# Altium schematic sheet TE0706.SchDoc: Overview
size A4; Organization: Trenz Electronic GmbH; DocumentNumber: TE0706; Revision: 02; SheetNumber: 1; SheetTotal: 10; Date: 2016-06-28; Author: Vitali Tsiukala; DrawnBy: Vitali Tsiukala; Engineer: Vitali Tsiukala
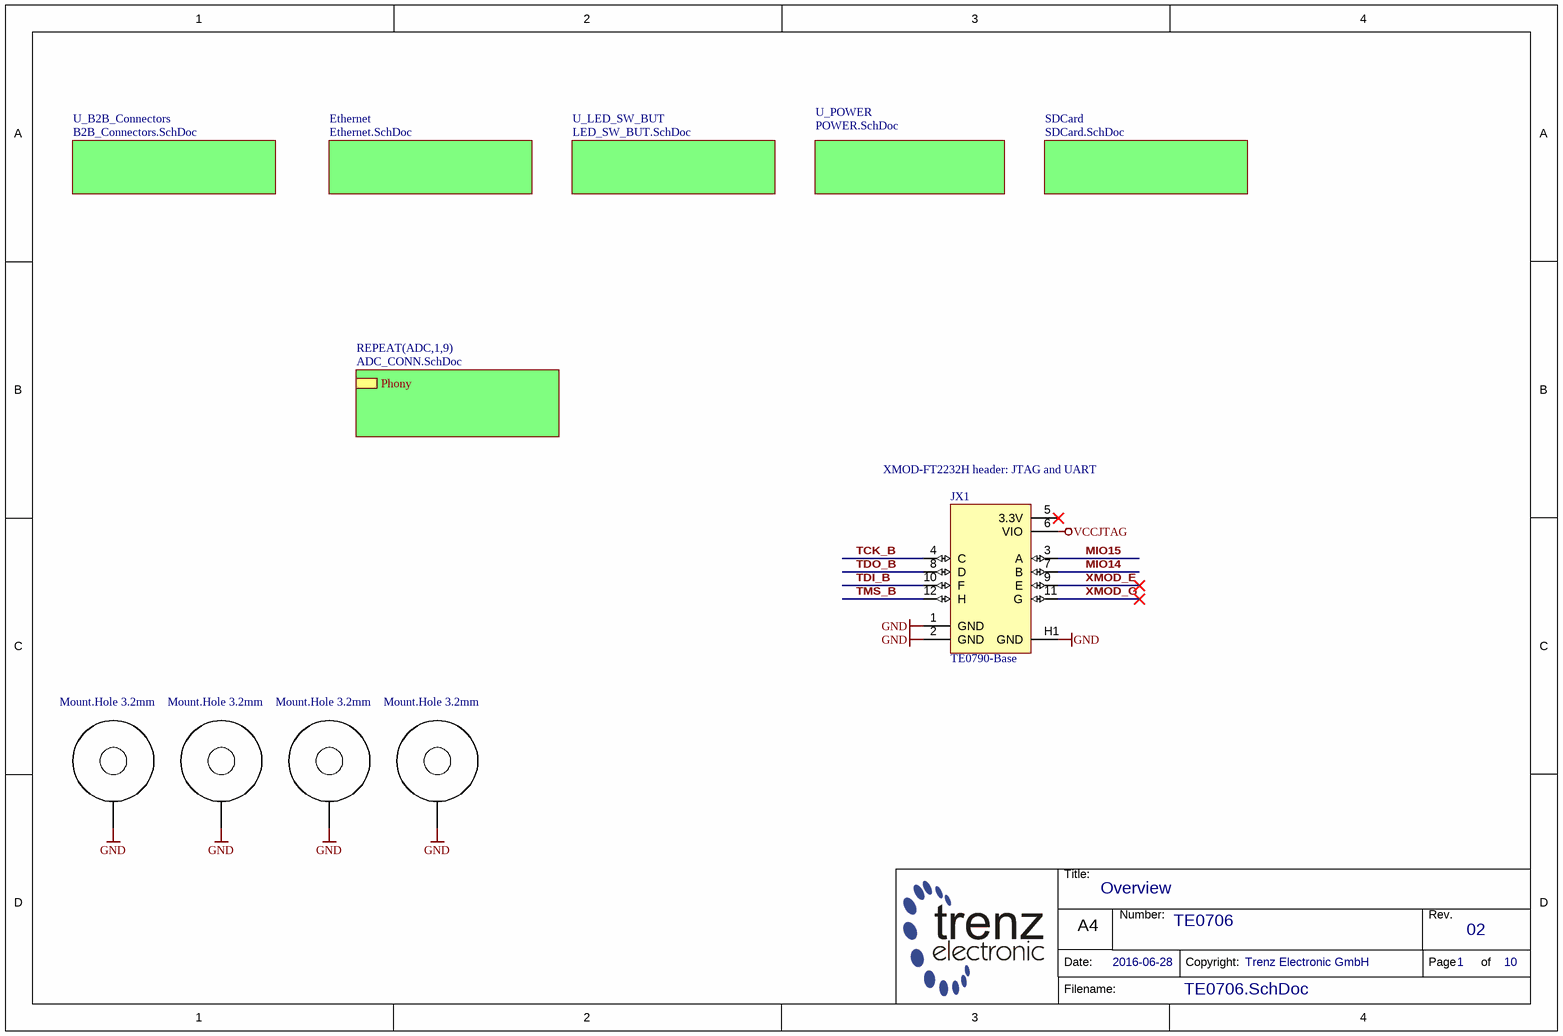
[diagram p0: TE0706.SchDoc]

## Parts
H1  Mount.Hole 3.2mm  [MHole3_2mm]  (no BOM)
H2  Mount.Hole 3.2mm  [MHole3_2mm]  (no BOM)
H3  Mount.Hole 3.2mm  [MHole3_2mm]  (no BOM)
H4  Mount.Hole 3.2mm  [MHole3_2mm]  (no BOM)
JX1  TE0790-Base  [TE0790-Base]

## Sub-sheets
Ethernet = Ethernet.SchDoc: no entries
REPEAT(ADC,1,9) = ADC_CONN.SchDoc: Phony
SDCard = SDCard.SchDoc: no entries
U_B2B_Connectors = B2B_Connectors.SchDoc: no entries
U_LED_SW_BUT = LED_SW_BUT.SchDoc: no entries
U_POWER = POWER.SchDoc: no entries

## Nets
GND: H1.1 H2.1 H3.1 H4.1 JX1.1(GND) JX1.2(GND) JX1.H1(GND)
VCCJTAG: JX1.6(VIO)
MIO14: JX1.7(B)
MIO15: JX1.3(A)
TCK_B: JX1.4(C)
TDI_B: JX1.10(F)
TDO_B: JX1.8(D)
TMS_B: JX1.12(H)
XMOD_E: JX1.9(E)
XMOD_G: JX1.11(G)

Not connected (* = marked no-connect by the designer): JX1 5(3.3V)*

## Notes on the sheet
- (near JX1) XMOD-FT2232H header: JTAG and UART
- Title:
- Number:
- Rev.
- Date:
- A4
- Copyright:
- Page
- of
- Filename:

## Library data of the parts
H1-H4 = 22898: AN: 22898; Mixed: THT
JX1 = 26694: AN: 26694; Mixed: THT; Trenz-Article-Number: 22495